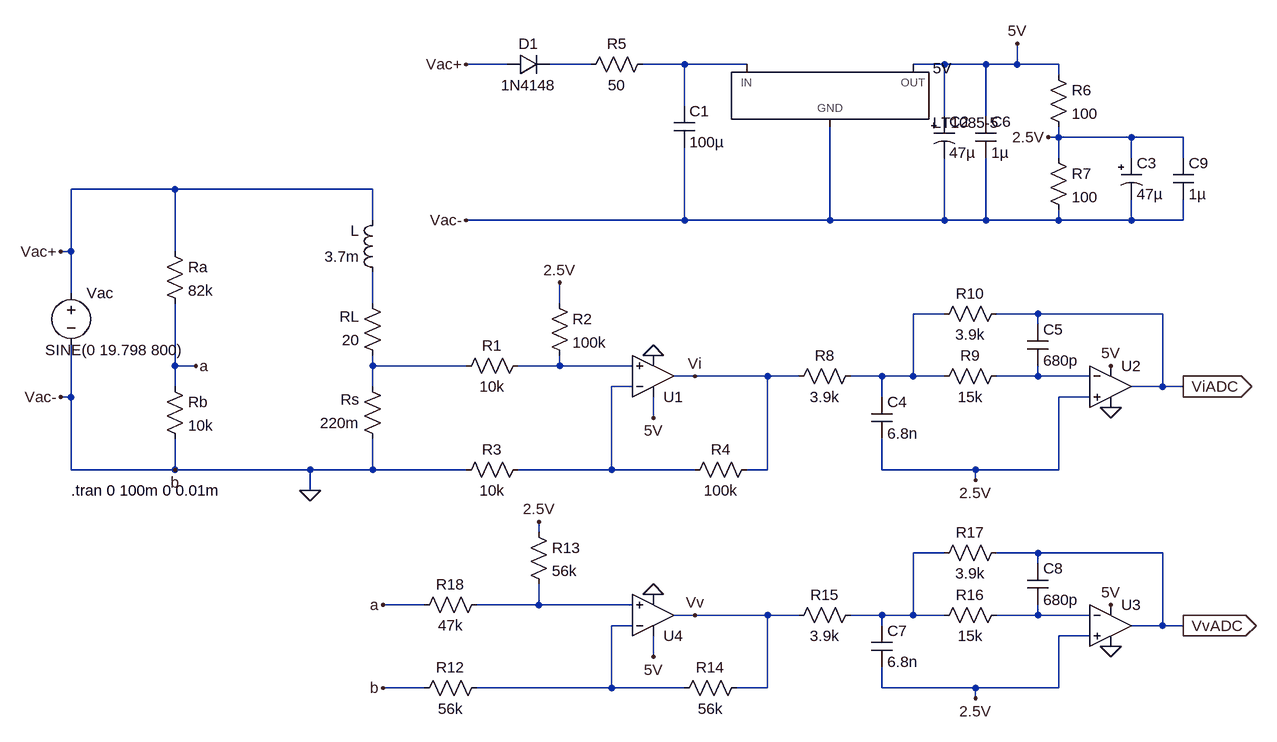
[diagram p0: schematic design_sensing_cleaner_version.asc]
design_sensing_cleaner_version.asc, the LTspice schematic file:
Version 4
SHEET 1 1588 884
WIRE 352 -224 288 -224
WIRE 480 -224 416 -224
WIRE 624 -224 560 -224
WIRE 720 -224 624 -224
WIRE 1024 -224 976 -224
WIRE 1088 -224 1024 -224
WIRE 1136 -224 1136 -256
WIRE 1136 -224 1088 -224
WIRE 1200 -224 1136 -224
WIRE 1200 -208 1200 -224
WIRE 624 -160 624 -224
WIRE 1024 -144 1024 -224
WIRE 1088 -144 1088 -224
WIRE 1200 -112 1200 -128
WIRE 1200 -112 1184 -112
WIRE 1312 -112 1200 -112
WIRE 1392 -112 1312 -112
WIRE 1200 -80 1200 -112
WIRE 1312 -80 1312 -112
WIRE 1392 -80 1392 -112
WIRE -160 -32 -320 -32
WIRE 144 -32 -160 -32
WIRE 144 16 144 -32
WIRE 624 16 624 -96
WIRE 624 16 288 16
WIRE 848 16 848 -128
WIRE 848 16 624 16
WIRE 1024 16 1024 -80
WIRE 1024 16 848 16
WIRE 1088 16 1088 -80
WIRE 1088 16 1024 16
WIRE 1200 16 1200 0
WIRE 1200 16 1088 16
WIRE 1312 16 1312 -16
WIRE 1312 16 1200 16
WIRE 1392 16 1392 -16
WIRE 1392 16 1312 16
WIRE -320 64 -320 -32
WIRE -320 64 -336 64
WIRE -160 64 -160 -32
WIRE -320 128 -320 64
WIRE 144 144 144 96
WIRE 432 144 432 112
WIRE 1024 160 976 160
WIRE 1168 160 1104 160
WIRE 1360 160 1168 160
WIRE 1168 176 1168 160
WIRE -160 240 -160 144
WIRE -128 240 -160 240
WIRE 144 240 144 224
WIRE 288 240 144 240
WIRE 432 240 432 224
WIRE 432 240 368 240
WIRE 544 240 432 240
WIRE 640 256 608 256
WIRE 752 256 640 256
WIRE 800 256 752 256
WIRE 928 256 880 256
WIRE 976 256 976 160
WIRE 976 256 928 256
WIRE 1024 256 976 256
WIRE 1168 256 1168 240
WIRE 1168 256 1104 256
WIRE 1248 256 1168 256
WIRE -160 272 -160 240
WIRE 144 272 144 240
WIRE 544 272 512 272
WIRE 1360 272 1360 160
WIRE 1360 272 1312 272
WIRE 1392 272 1360 272
WIRE -320 288 -320 208
WIRE -320 288 -336 288
WIRE 928 288 928 256
WIRE 1248 288 1200 288
WIRE 576 320 576 288
WIRE -320 400 -320 288
WIRE -160 400 -160 352
WIRE -160 400 -320 400
WIRE 48 400 -160 400
WIRE 144 400 144 352
WIRE 144 400 48 400
WIRE 288 400 144 400
WIRE 512 400 512 272
WIRE 512 400 368 400
WIRE 640 400 512 400
WIRE 752 400 752 256
WIRE 752 400 720 400
WIRE 928 400 928 352
WIRE 1072 400 928 400
WIRE 1200 400 1200 288
WIRE 1200 400 1072 400
WIRE 1072 416 1072 400
WIRE 48 432 48 400
WIRE 400 496 400 480
WIRE 1024 528 976 528
WIRE 1168 528 1104 528
WIRE 1360 528 1168 528
WIRE 1168 544 1168 528
WIRE 224 608 160 608
WIRE 400 608 400 576
WIRE 400 608 304 608
WIRE 544 608 400 608
WIRE 640 624 608 624
WIRE 752 624 640 624
WIRE 800 624 752 624
WIRE 928 624 880 624
WIRE 976 624 976 528
WIRE 976 624 928 624
WIRE 1024 624 976 624
WIRE 1168 624 1168 608
WIRE 1168 624 1104 624
WIRE 1248 624 1168 624
WIRE 544 640 512 640
WIRE 928 640 928 624
WIRE 1360 640 1360 528
WIRE 1360 640 1312 640
WIRE 1392 640 1360 640
WIRE 1248 656 1200 656
WIRE 576 688 576 656
WIRE 224 736 160 736
WIRE 512 736 512 640
WIRE 512 736 304 736
WIRE 624 736 512 736
WIRE 752 736 752 624
WIRE 752 736 704 736
WIRE 928 736 928 704
WIRE 1072 736 928 736
WIRE 1200 736 1200 656
WIRE 1200 736 1072 736
WIRE 1072 752 1072 736
FLAG 1392 272 ViADC
IOPIN 1392 272 Out
FLAG 48 432 0
FLAG 576 224 0
FLAG 1280 304 0
FLAG 1184 -112 2.5V
FLAG 1072 416 2.5V
FLAG 576 592 0
FLAG 1392 640 VvADC
IOPIN 1392 640 Out
FLAG 1280 672 0
FLAG 1072 752 2.5V
FLAG 640 624 Vv
FLAG 640 256 Vi
FLAG 1136 -256 5V
FLAG 1280 240 5V
FLAG 576 320 5V
FLAG 1280 608 5V
FLAG 576 688 5V
FLAG 432 112 2.5V
FLAG 400 480 2.5V
FLAG -128 240 a
FLAG -160 400 b
FLAG 160 608 a
FLAG 160 736 b
FLAG -336 64 Vac+
FLAG -336 288 Vac-
FLAG 288 16 Vac-
FLAG 288 -224 Vac+
SYMBOL voltage -320 112 R0
WINDOW 123 0 0 Left 2
WINDOW 39 0 0 Left 2
WINDOW 3 -40 104 Left 2
SYMATTR Value SINE(0 19.798 800)
SYMATTR InstName Vac
SYMBOL ind 160 112 R180
WINDOW 0 36 80 Left 2
WINDOW 3 36 40 Left 2
SYMATTR InstName L
SYMATTR Value 3.7m
SYMBOL res 160 240 R180
WINDOW 0 36 76 Left 2
WINDOW 3 36 40 Left 2
SYMATTR InstName RL
SYMATTR Value 20
SYMATTR SpiceLine pwr=200m
SYMBOL res 160 368 R180
WINDOW 0 36 76 Left 2
WINDOW 3 36 40 Left 2
SYMATTR InstName Rs
SYMATTR Value 220m
SYMATTR SpiceLine pwr=200m
SYMBOL res 384 224 R90
WINDOW 0 0 56 VBottom 2
WINDOW 3 32 56 VTop 2
SYMATTR InstName R1
SYMATTR Value 10k
SYMBOL res 384 384 R90
WINDOW 0 0 56 VBottom 2
WINDOW 3 32 56 VTop 2
SYMATTR InstName R3
SYMATTR Value 10k
SYMBOL res 416 128 R0
SYMATTR InstName R2
SYMATTR Value 100k
SYMBOL Opamps\\UniversalOpamp2 576 256 M180
SYMATTR InstName U1
SYMBOL res 736 384 R90
WINDOW 0 0 56 VBottom 2
WINDOW 3 32 56 VTop 2
SYMATTR InstName R4
SYMATTR Value 100k
SYMBOL diode 352 -208 R270
WINDOW 0 32 32 VTop 2
WINDOW 3 0 32 VBottom 2
SYMATTR InstName D1
SYMATTR Value 1N4148
SYMBOL res 576 -240 R90
WINDOW 0 0 56 VBottom 2
WINDOW 3 32 56 VTop 2
SYMATTR InstName R5
SYMATTR Value 50
SYMBOL cap 608 -160 R0
SYMATTR InstName C1
SYMATTR Value 100µ
SYMBOL PowerProducts\\LT1085-5 848 -224 R0
SYMATTR InstName 5V
SYMBOL res 1184 -224 R0
SYMATTR InstName R6
SYMATTR Value 100
SYMBOL res 1184 -96 R0
SYMATTR InstName R7
SYMATTR Value 100
SYMBOL polcap 1296 -80 R0
WINDOW 3 24 56 Left 2
SYMATTR InstName C3
SYMATTR Value 47µ
SYMATTR Description Capacitor
SYMATTR Type cap
SYMATTR SpiceLine V=6.3 Irms=65m Rser=2.1 Lser=0 mfg="Nichicon" pn="UPR0J470MAH" type="Al electrolytic"
SYMBOL res 896 240 R90
WINDOW 0 0 56 VBottom 2
WINDOW 3 32 56 VTop 2
SYMATTR InstName R8
SYMATTR Value 3.9k
SYMBOL cap 912 288 R0
SYMATTR InstName C4
SYMATTR Value 6.8n
SYMBOL res 1120 240 R90
WINDOW 0 0 56 VBottom 2
WINDOW 3 32 56 VTop 2
SYMATTR InstName R9
SYMATTR Value 15k
SYMBOL res 1120 144 R90
WINDOW 0 0 56 VBottom 2
WINDOW 3 32 56 VTop 2
SYMATTR InstName R10
SYMATTR Value 3.9k
SYMBOL cap 1152 176 R0
SYMATTR InstName C5
SYMATTR Value 680p
SYMBOL Opamps\\UniversalOpamp2 1280 272 R0
SYMATTR InstName U2
SYMBOL polcap 1008 -144 R0
WINDOW 3 24 56 Left 2
SYMATTR Value 47µ
SYMATTR InstName C2
SYMATTR Description Capacitor
SYMATTR Type cap
SYMATTR SpiceLine V=35 Irms=170m Rser=1 Lser=0 mfg="Nichicon" pn="UPG1V470MPH" type="Al electrolytic"
SYMBOL cap 1072 -144 R0
SYMATTR InstName C6
SYMATTR Value 1µ
SYMATTR SpiceLine V=25 Irms=0 Rser=0.007 Lser=0 mfg="TDK" pn="C3216X7RIE105M" type="X7R"
SYMBOL res -176 48 R0
SYMATTR InstName Ra
SYMATTR Value 82k
SYMBOL res -176 256 R0
SYMATTR InstName Rb
SYMATTR Value 10k
SYMBOL res 208 752 R270
WINDOW 0 32 56 VTop 2
WINDOW 3 0 56 VBottom 2
SYMATTR InstName R12
SYMATTR Value 56k
SYMBOL res 384 480 R0
SYMATTR InstName R13
SYMATTR Value 56k
SYMBOL Opamps\\UniversalOpamp2 576 624 M180
SYMATTR InstName U4
SYMBOL res 608 752 R270
WINDOW 0 32 56 VTop 2
WINDOW 3 0 56 VBottom 2
SYMATTR InstName R14
SYMATTR Value 56k
SYMBOL res 784 640 R270
WINDOW 0 32 56 VTop 2
WINDOW 3 0 56 VBottom 2
SYMATTR InstName R15
SYMATTR Value 3.9k
SYMBOL cap 912 640 R0
SYMATTR InstName C7
SYMATTR Value 6.8n
SYMBOL res 1120 608 R90
WINDOW 0 0 56 VBottom 2
WINDOW 3 32 56 VTop 2
SYMATTR InstName R16
SYMATTR Value 15k
SYMBOL res 1120 512 R90
WINDOW 0 0 56 VBottom 2
WINDOW 3 32 56 VTop 2
SYMATTR InstName R17
SYMATTR Value 3.9k
SYMBOL cap 1152 544 R0
SYMATTR InstName C8
SYMATTR Value 680p
SYMBOL Opamps\\UniversalOpamp2 1280 640 R0
SYMATTR InstName U3
SYMBOL res 208 624 R270
WINDOW 0 32 56 VTop 2
WINDOW 3 0 56 VBottom 2
SYMATTR InstName R18
SYMATTR Value 47k
SYMBOL cap 1376 -80 R0
SYMATTR InstName C9
SYMATTR Value 1µ
SYMATTR SpiceLine V=25 Irms=0 Rser=0.007 Lser=0 mfg="TDK" pn="C3216X7RIE105M" type="X7R"
TEXT -320 432 Left 2 !.tran 0 100m 0 0.01m

The netlist it stands for:
* design_sensing_cleaner_version.asc
Vac Vac+ 0 SINE(0 19.798 800)
L N003 Vac+ 3.7m
RL N005 N003 20 pwr=200m
Rs 0 N005 220m pwr=200m
R1 N006 N005 10k
R3 N008 0 10k
R2 2.5V N006 100k
XU1 N006 N008 5V 0 Vi level.2 Avol=1Meg GBW=10Meg Slew=10Meg ilimit=25m rail=0 Vos=0 phimargin=45 en=0 enk=0 in=0 ink=0 Rin=500Meg  ; pins IN+ IN- V+ V- OUT
R4 Vi N008 100k
D1 Vac+ N001 1N4148
R5 N002 N001 50
C1 N002 0 100µ
X5V 0 5V N002 LT1085-5  ; pins GND OUT IN
R6 5V 2.5V 100
R7 2.5V 0 100
C3 2.5V 0 47µ V=6.3 Irms=65m Rser=2.1 Lser=0 mfg="Nichicon" pn="UPR0J470MAH" type="Al electrolytic"
R8 N004 Vi 3.9k
C4 N004 2.5V 6.8n
R9 N007 N004 15k
R10 ViADC N004 3.9k
C5 ViADC N007 680p
XU2 2.5V N007 5V 0 ViADC level.2 Avol=1Meg GBW=10Meg Slew=10Meg ilimit=25m rail=0 Vos=0 phimargin=45 en=0 enk=0 in=0 ink=0 Rin=500Meg  ; pins IN+ IN- V+ V- OUT
C2 5V 0 47µ V=35 Irms=170m Rser=1 Lser=0 mfg="Nichicon" pn="UPG1V470MPH" type="Al electrolytic"
C6 5V 0 1µ V=25 Irms=0 Rser=0.007 Lser=0 mfg="TDK" pn="C3216X7RIE105M" type="X7R"
Ra Vac+ a 82k
Rb a 0 10k
R12 0 N012 56k
R13 2.5V N010 56k
XU4 N010 N012 5V 0 Vv level.2 Avol=1Meg GBW=10Meg Slew=10Meg ilimit=25m rail=0 Vos=0 phimargin=45 en=0 enk=0 in=0 ink=0 Rin=500Meg  ; pins IN+ IN- V+ V- OUT
R14 N012 Vv 56k
R15 Vv N009 3.9k
C7 N009 2.5V 6.8n
R16 N011 N009 15k
R17 VvADC N009 3.9k
C8 VvADC N011 680p
XU3 2.5V N011 5V 0 VvADC level.2 Avol=1Meg GBW=10Meg Slew=10Meg ilimit=25m rail=0 Vos=0 phimargin=45 en=0 enk=0 in=0 ink=0 Rin=500Meg  ; pins IN+ IN- V+ V- OUT
R18 a N010 47k
C9 2.5V 0 1µ V=25 Irms=0 Rser=0.007 Lser=0 mfg="TDK" pn="C3216X7RIE105M" type="X7R"
.model D D
.lib standard.dio
.tran 0 100m 0 0.01m
.lib UniversalOpamps2.sub
.backanno
.end